# Altium schematic sheet DhcpDns.SchDoc
size A
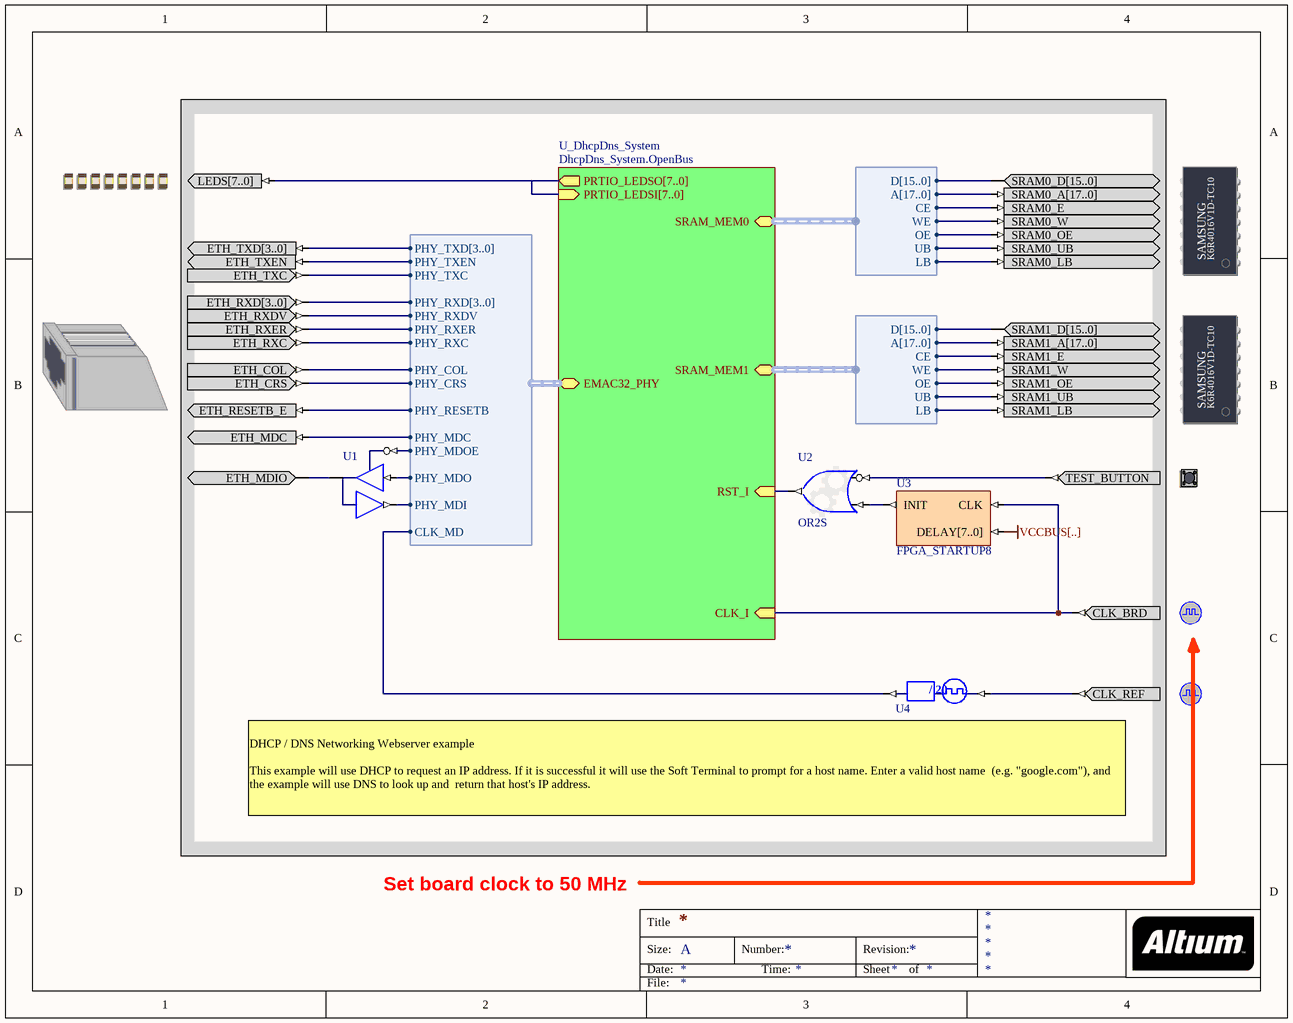
[diagram p0: DhcpDns.SchDoc]

## Parts
(Parts that share a designator on the sheet are numbered #1, #2 ... from top to bottom, then left to right.)
?#1  LED  (value not drawn)
?#2  SRAM_DAUGHTER0  (value not drawn)
?#3  ETH_PHY  (value not drawn)
?#4  SRAM_DAUGHTER1  (value not drawn)
?#5  TEST_BUTTON  (value not drawn)
?#6  CLOCK_BOARD  (value not drawn)
?#7  CLOCK_REFERENCE  (value not drawn)
U1  IOBUF  (value not drawn)
U2  OR2S
U3  FPGA_STARTUP8
U4  CDIV20DC50  (value not drawn)

## Sub-sheets
U_DhcpDns_System = DhcpDns_System.OpenBus: RST_I (in), CLK_I (in), EMAC32_PHY (harness EMAC32), SRAM_MEM0 (harness WB_MEM_CTRL_SRAM16_A18), SRAM_MEM1 (harness WB_MEM_CTRL_SRAM16_A18), PRTIO_LEDSO[7..0] (out), PRTIO_LEDSI[7..0] (in)

## Harnesses
EMAC32: PHY_TXD[3..0], PHY_TXEN, PHY_TXC, PHY_RXD[3..0], PHY_RXDV, PHY_RXER, PHY_RXC, PHY_COL, PHY_CRS, PHY_RESETB, PHY_MDC, PHY_MDOE, PHY_MDO, PHY_MDI, CLK_MD
WB_MEM_CTRL_SRAM16_A18: D[15..0], A[17..0], CE, WE, OE, UB, LB

## Nets
VCCBUS[..]: U3.DELAY[7..0]
Net?#1_LEDS[7..0]: ?#1.LEDS[7..0] ; sheet U_DhcpDns_System/PRTIO_LEDSO[7..0], sheet U_DhcpDns_System/PRTIO_LEDSI[7..0]
Net?#2_SRAM0_A[17..0]: ?#2.SRAM0_A[17..0] ; sheet U_DhcpDns_System/SRAM_MEM0.A[17..0]
Net?#2_SRAM0_D[15..0]: ?#2.SRAM0_D[15..0] ; sheet U_DhcpDns_System/SRAM_MEM0.D[15..0]
Net?#2_SRAM0_E: ?#2.SRAM0_E ; sheet U_DhcpDns_System/SRAM_MEM0.CE
Net?#2_SRAM0_LB: ?#2.SRAM0_LB ; sheet U_DhcpDns_System/SRAM_MEM0.LB
Net?#2_SRAM0_OE: ?#2.SRAM0_OE ; sheet U_DhcpDns_System/SRAM_MEM0.OE
Net?#2_SRAM0_UB: ?#2.SRAM0_UB ; sheet U_DhcpDns_System/SRAM_MEM0.UB
Net?#2_SRAM0_W: ?#2.SRAM0_W ; sheet U_DhcpDns_System/SRAM_MEM0.WE
Net?#3_ETH_COL: ?#3.ETH_COL ; sheet U_DhcpDns_System/EMAC32_PHY.PHY_COL
Net?#3_ETH_CRS: ?#3.ETH_CRS ; sheet U_DhcpDns_System/EMAC32_PHY.PHY_CRS
Net?#3_ETH_MDC: ?#3.ETH_MDC ; sheet U_DhcpDns_System/EMAC32_PHY.PHY_MDC
Net?#3_ETH_MDIO: ?#3.ETH_MDIO U1.IO
Net?#3_ETH_RESETB_E: ?#3.ETH_RESETB_E ; sheet U_DhcpDns_System/EMAC32_PHY.PHY_RESETB
Net?#3_ETH_RXC: ?#3.ETH_RXC ; sheet U_DhcpDns_System/EMAC32_PHY.PHY_RXC
Net?#3_ETH_RXD[3..0]: ?#3.ETH_RXD[3..0] ; sheet U_DhcpDns_System/EMAC32_PHY.PHY_RXD[3..0]
Net?#3_ETH_RXDV: ?#3.ETH_RXDV ; sheet U_DhcpDns_System/EMAC32_PHY.PHY_RXDV
Net?#3_ETH_RXER: ?#3.ETH_RXER ; sheet U_DhcpDns_System/EMAC32_PHY.PHY_RXER
Net?#3_ETH_TXC: ?#3.ETH_TXC ; sheet U_DhcpDns_System/EMAC32_PHY.PHY_TXC
Net?#3_ETH_TXD[3..0]: ?#3.ETH_TXD[3..0] ; sheet U_DhcpDns_System/EMAC32_PHY.PHY_TXD[3..0]
Net?#3_ETH_TXEN: ?#3.ETH_TXEN ; sheet U_DhcpDns_System/EMAC32_PHY.PHY_TXEN
Net?#4_SRAM1_A[17..0]: ?#4.SRAM1_A[17..0] ; sheet U_DhcpDns_System/SRAM_MEM1.A[17..0]
Net?#4_SRAM1_D[15..0]: ?#4.SRAM1_D[15..0] ; sheet U_DhcpDns_System/SRAM_MEM1.D[15..0]
Net?#4_SRAM1_E: ?#4.SRAM1_E ; sheet U_DhcpDns_System/SRAM_MEM1.CE
Net?#4_SRAM1_LB: ?#4.SRAM1_LB ; sheet U_DhcpDns_System/SRAM_MEM1.LB
Net?#4_SRAM1_OE: ?#4.SRAM1_OE ; sheet U_DhcpDns_System/SRAM_MEM1.OE
Net?#4_SRAM1_UB: ?#4.SRAM1_UB ; sheet U_DhcpDns_System/SRAM_MEM1.UB
Net?#4_SRAM1_W: ?#4.SRAM1_W ; sheet U_DhcpDns_System/SRAM_MEM1.WE
Net?#5_TEST_BUTTON: ?#5.TEST_BUTTON U2.I0
Net?#6_CLK_BRD: ?#6.CLK_BRD U3.CLK ; sheet U_DhcpDns_System/CLK_I
Net?#7_CLK_REF: ?#7.CLK_REF U4.CLKIN
NetU1_I: U1.I ; sheet U_DhcpDns_System/EMAC32_PHY.PHY_MDO
NetU1_O: U1.O ; sheet U_DhcpDns_System/EMAC32_PHY.PHY_MDI
NetU1_T: U1.T ; sheet U_DhcpDns_System/EMAC32_PHY.PHY_MDOE
NetU2_I1: U2.I1 U3.INIT
NetU2_O: U2.O ; sheet U_DhcpDns_System/RST_I
NetU4_CLKDV: U4.CLKDV ; sheet U_DhcpDns_System/EMAC32_PHY.CLK_MD

## Buses and harness runs
bus sheet U_DhcpDns_System/PRTIO_LEDSI[7..0] = sheet U_DhcpDns_System/PRTIO_LEDSO[7..0]

## Notes on the sheet
- (near U4) DHCP / DNS Networking Webserver example
  This example will use DHCP to request an IP address. If it is successful it will use the Soft Terminal to prompt for a host name. Enter a valid host name  (e.g. "google.com"), and the example will use DNS to look up and  return that host's IP address.
- Set board clock to 50 MHz
- Title
- Size:
- Date:
- A
- Number:
- Time:
- Revision:
- Sheet
- of
- File:
- (in symbol CDIV20DC50) / 20
- (in symbol SRAM_DAUGHTER0) SAMSUNG; K6R4016V1D-TC10
- (in symbol SRAM_DAUGHTER1) SAMSUNG; K6R4016V1D-TC10

## Library data of the parts
?#1 = LED: Bank of eight Red LEDs; PortComponent: True; Published: 19-Nov-2003; Publisher: Altium Limited; HelpURL: TR0143 Technical Reference Manual for Altium's Desktop NanoBoard NB2DSK01.pdf#page=51
?#2 = SRAM_DAUGHTER0: Free Static RAM - Daughterboard; PortComponent: True; Published: 14-May-2007; Publisher: Altium Limited; HelpURL: TR0149 Technical Reference for Altium's Xilinx Spartan-3 Daughter Board DB30.pdf#page=16
?#3 = ETH_PHY: Ethernet PHY-interface; PortComponent: True; Published: 22-Jan-2007; Publisher: Altium Limited; HelpURL: TR0147 Technical Reference for Altium's USB-IrDA-Ethernet Peripheral Board PB03.pdf#page=7
?#4 = SRAM_DAUGHTER1: Free Static RAM - Daughterboard; PortComponent: True; Published: 14-May-2007; Publisher: Altium Limited; HelpURL: TR0149 Technical Reference for Altium's Xilinx Spartan-3 Daughter Board DB30.pdf#page=16
?#5 = TEST_BUTTON: Test / Reset Button; PortComponent: True; Published: 19-Nov-2003; Publisher: Altium Limited; HelpURL: TR0143 Technical Reference Manual for Altium's Desktop NanoBoard NB2DSK01.pdf#page=53
?#6 = CLOCK_BOARD: Global System Clock Supply; PortComponent: True; Published: 19-Nov-2003; Publisher: Altium Limited; HelpURL: TR0143 Technical Reference Manual for Altium's Desktop NanoBoard NB2DSK01.pdf#page=41; UseInDSF: True
?#7 = CLOCK_REFERENCE: Global System Clock Reference Supply; PortComponent: True; Published: 19-Nov-2003; Publisher: Altium Limited; HelpURL: TR0143 Technical Reference Manual for Altium's Desktop NanoBoard NB2DSK01.pdf#page=41
U1 = iobuf: Input/Output Buffer; Enable: Low; Control: Common Control T; ArchiveName: GENERIC; VHDLIB_SIM: GENERIC_LIB; Published: 29-Jan-2004; Publisher: Altium Limited; XilinxEquivalent: IOBUF; LastRevisionNo: 1.00.00; HelpURL: CR0118 FPGA Generic Library Guide.pdf#page=293; ComponentLink1URL: CR0125 FPGA Buffer Resource Usage.pdf#page=78; ComponentLink1Description: Core &Resource Usage; FunctionalClass: Buffer; SubClass: IOBUF
U2 = GATE: Configurable Generic Gate; ConfiguratorName: GENERIC_GATE; ConfigurationParameters: {}Version[1.0]{}GateKind[OR]{}BusInput[False]{}GateInputType[Bit]{}GateOutputOption[Normal]{}BusWidth[8]{}RegisterOutputs[False]{}NegativeClockEdge[False]{}InputCount[2]{}InputInvert0[True]{}InputInvert1[False]{}; LastRevisionNo: 1.00.00; Published: 3-Sep-2008; Publisher: Altium Limited
U3 = FPGA_STARTUP8: FPGA Startup With 8 Bit Delay; Published: 9-Dec-2004; Publisher: Altium Limited; HelpURL: CR0119 FPGA_STARTUPx Powerup Delay Unit.pdf; LastRevisionNo: 1.00.00; ComponentLink1Description: Core &Resource Usage; ComponentLink1URL: CR0139 FPGA Peripheral Resource Usage.pdf#page=11
U4 = CDIV20DC50: Clock Divider by 20 with 50% Duty Cycle Output; DivisorRate: 20; DutyCycle: 50; ArchiveName: GENERIC; VHDLIB_SIM: GENERIC_LIB; Published: 29-Jan-2004; Publisher: Altium Limited; LastRevisionNo: 1.00.00; HelpURL: CR0118 FPGA Generic Library Guide.pdf#page=143; ComponentLink1URL: CR0127 FPGA Clock Divider Resource Usage.pdf#page=21; ComponentLink1Description: Core &Resource Usage; FunctionalClass: Clock Divider